# EAGLE design board (EAGLE 9.5.1)
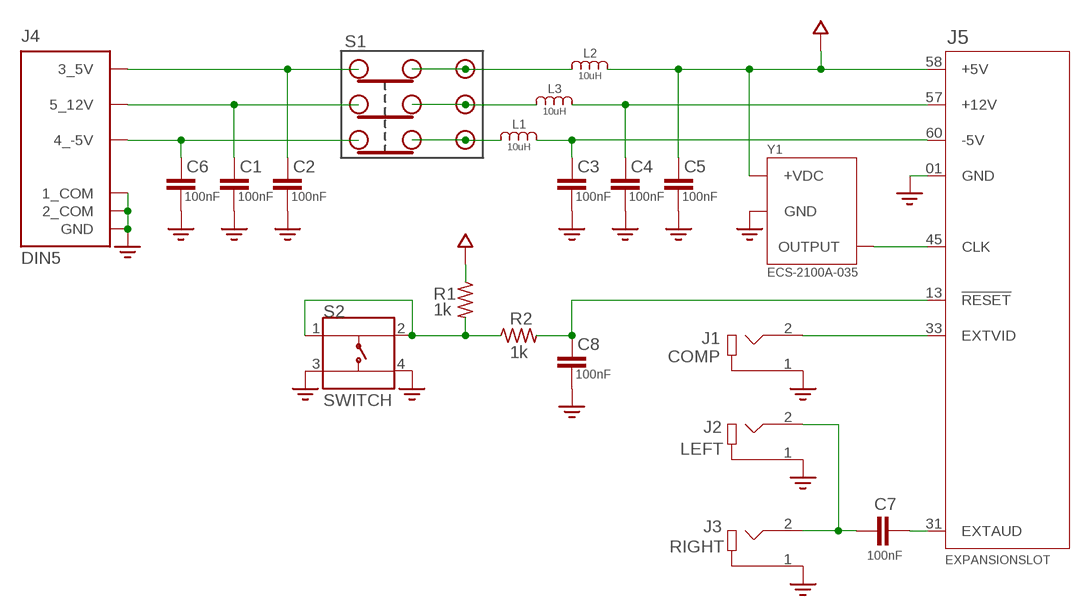
[diagram p0: schematic, sheet 1]

## Parts
C1  100nF  CAPACITOR050-035X075  [C050-035X075]
C2  100nF  CAPACITOR050-035X075  [C050-035X075]
C3  100nF  CAPACITOR050-035X075  [C050-035X075]
C4  100nF  CAPACITOR050-035X075  [C050-035X075]
C5  100nF  CAPACITOR050-035X075  [C050-035X075]
C6  100nF  CAPACITOR050-035X075  [C050-035X075]
C7  100nF  CAPACITOR050-035X075  [C050-035X075]
C8  100nF  CAPACITOR050-035X075  [C050-035X075]
J1  COMP  RCA  [CUI_RCJ-042]
J2  LEFT  RCA  [CUI_RCJ-042]
J3  RIGHT  RCA  [CUI_RCJ-042]
J4  DIN5  [CUI_SDS-50J]
J5  EXPANSIONSLOT  [EXPANSIONSLOT]
L1  10uH  INDUCTOR  [1100R_MUR]
L2  10uH  INDUCTOR  [1100R_MUR]
L3  10uH  INDUCTOR  [1100R_MUR]
R1  1k  RESISTOR0207/10  [0207/10]
R2  1k  RESISTOR0207/10  [0207/10]
S1  3PDT  [3PDT]
S2  SWITCH  [SW_2-1825910-7]
Y1  ECS-2100A-035  [OSC_ECS-2100A-035]

## Nets
5V: C5.1 J5.58(+5V) L2.1 R1.1 Y1.8(+VDC)
5V_IN: C2.1 J4.3(3_5V) S1.P$1C
12V: C4.1 J5.57(+12V) L3.1
12V_IN2: C1.1 J4.5(5_12V) S1.P$2C
GND: C1.2 C2.2 C3.2 C4.2 C5.2 C6.2 C8.2 J1.1 J2.1 J3.1 J4.1(1_COM) J4.2(2_COM) J4.E1(GND) J4.E2(GND) J5.01(GND) S2.3 S2.4 Y1.4(GND)
M5V2: C3.1 J5.60(-5V) L1.1
M5V_IN: C6.1 J4.4(4_-5V) S1.P$3C
N$1: L1.2 S1.P$3A S1.P$3B
N$2: L3.2 S1.P$2A S1.P$2B
N$3: L2.2 S1.P$1A S1.P$1B
N$7: R1.2 R2.1 S2.1 S2.2
N$10: J5.45(CLK) Y1.5(OUTPUT)
N$11: J1.2 J5.33(EXTVID)
N$12: C7.1 J5.31(EXTAUD)
N$14: C8.1 J5.13(!RESET) R2.2
N$15: C7.2 J2.2 J3.2

## Library data of the parts
C1-C8 = expansion1-adapter:CAPACITOR: CAPACITOR, European symbol; SPICEPREFIX: C
J1-J3 = expansion1-adapter:RCA: Metal Right-Angle, RCA Jack, Red Housing and Insulation Check prices <https://pricing.snapeda.com/parts/RCJ-042/CUI%20Devices/view-part?ref=eda>; AVAILABILITY: Good; CUI_PURCHASE_URL: https://www.cuidevices.com/product/interconnect/connectors/rca-connectors/rcj-04-series?utm_source=snapeda.com&utm_medium=referral&utm_campaign=snapedaBOM; DESCRIPTION: Metal Right-Angle, RCA Jack, Red Housing and Insulation; MF: CUI Devices; MP: RCJ-042; PACKAGE: None; PRICE: None; PURCHASE-URL: https://pricing.snapeda.com/search/part/RCJ-042/?ref=eda
J4 = expansion1-adapter:DIN5; CUI_PURCHASE_URL: https://www.cuidevices.com/product/interconnect/connectors/din-connectors/sds-j-series?utm_source=snapeda.com&utm_medium=referral&utm_campaign=snapedaBOM; DESCRIPTION: 3~13 Positions, Receptacle, Right Angle, Through Hole, Standard Circular DIN Connector; DIGI-KEY_PART_NUMBER: CP-2350-ND; MF: CUI Devices; MP: SDS-50J; PACKAGE: None; PURCHASE-URL: https://pricing.snapeda.com/search/part/SDS-50J/?ref=eda
J5 = expansion1-adapter:EXPANSIONSLOT
L1-L3 = expansion1-adapter:INDUCTOR; BUILT_BY: EMA_UL_Team; MANUFACTURER_PART_NUMBER: 11R103C; SOURCELIBRARY: Murata_2012-11-05_1100R; VENDOR: Murata
R1 R2 = expansion1-adapter:RESISTOR: RESISTOR, American symbol
S1 = expansion1-adapter:3PDT: 3PDT slide switch, CW Industries, GF-161-0005
S2 = expansion1-adapter:SWITCH: Switch Tactile OFF (ON) SPST Extended Round Button PC Pins 0.05A 24VDC 100000Cycle 1.57N Thru-Hole Loose Piece; COMMENT: 2-1825910-7; DESCRIPTION: Switch Tactile OFF (ON) SPST Extended Round Button PC Pins 0.05A 24VDC 100000Cycle 1.57N Thru-Hole Loose Piece; DIGI-KEY_PART_NUMBER: 450-1642-ND; EU_ROHS_COMPLIANCE: Compliant; MF: TE Connectivity; MP: 2-1825910-7; PACKAGE: None; PURCHASE-URL: https://pricing.snapeda.com/search/part/2-1825910-7/?ref=eda
Y1 = expansion1-adapter:ECS-2100A-035; DESCRIPTION: Oscillator XO 3.579545MHz ±100ppm 50pF HCMOS/TTL 55% 5V 4-Pin Metal DIP Thru-Hole; DIGI-KEY_PART_NUMBER: XC235-ND; MF: ECS Inc.; MP: ECS-2100A-035; PACKAGE: DIP-8 ECS International; PURCHASE-URL: https://pricing.snapeda.com/search/part/ECS-2100A-035/?ref=eda

## Board
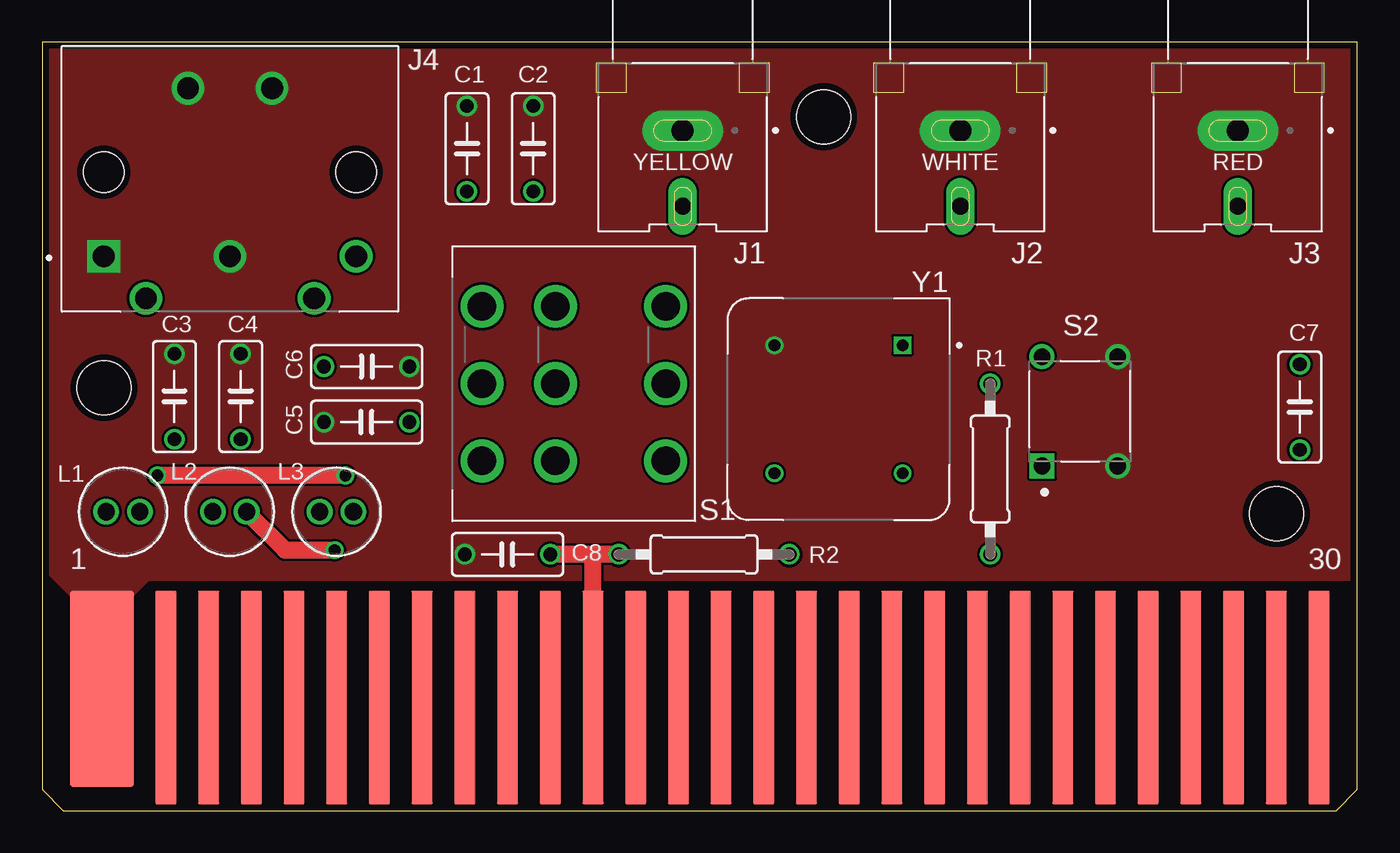
[diagram p1: board, top side]
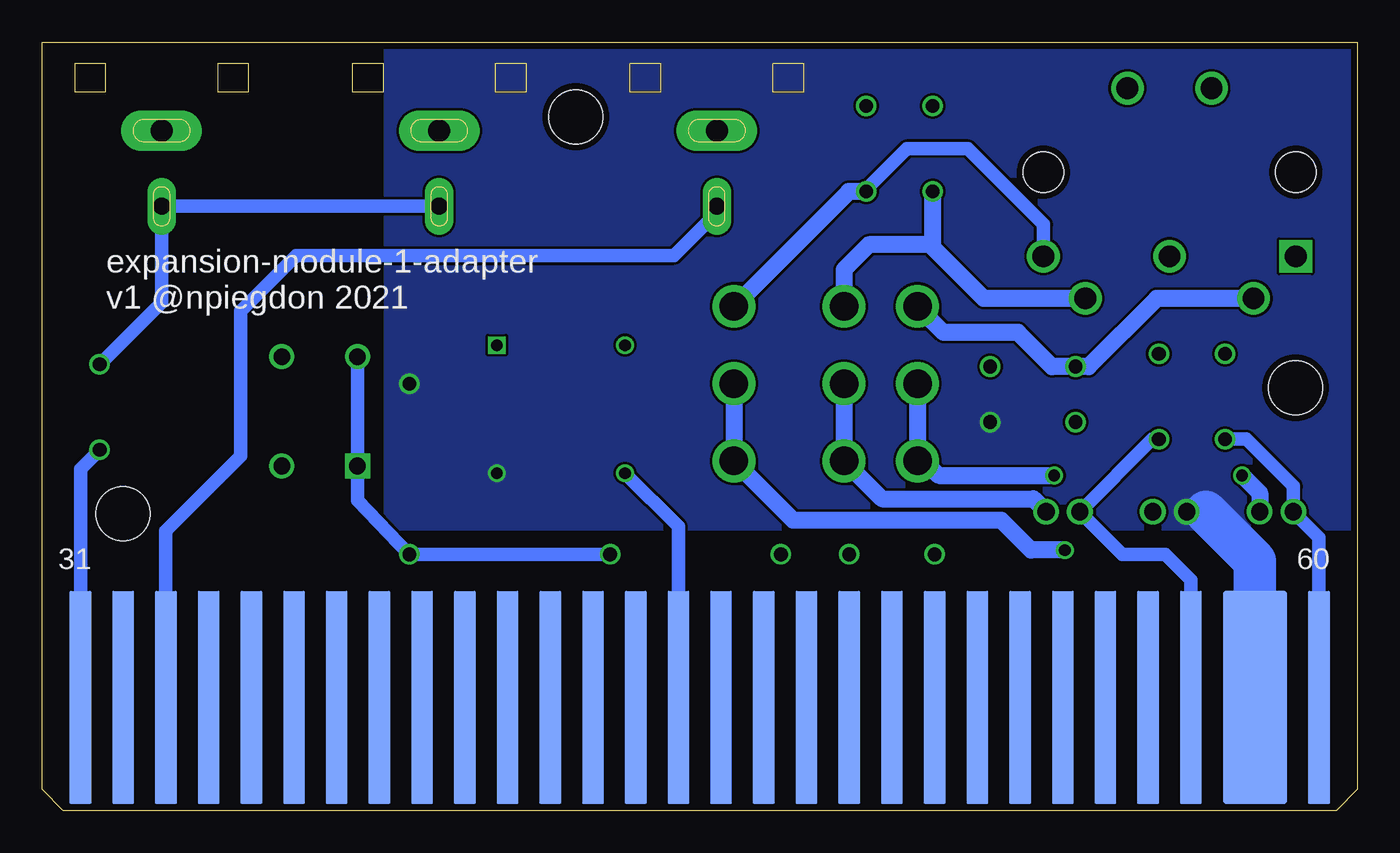
[diagram p2: board, bottom side, seen from below]

Size 78.23 x 45.72 mm. Coordinates in mm from the lower left corner, seen from the top.
Outline: 78.23,45.72 0,45.72 0,1.27 1.27,0 76.96,0 78.23,1.27 78.23,45.72
Copper layers (1*16): Top 0.035559375mm / dielectric 1.6mm / Bottom 0.035559375mm
Design rules "oshpark-2layer-tented": minimum track width 6mil, minimum drill 10mil, track to track 6mil, track to pad 6mil, pad to pad 6mil, via to via 6mil, smd to smd 6mil, copper to edge 15mil, drill to drill 6mil, minimum pad ring 5mil, minimum via ring 5mil, stop-mask expansion 2.5mil, vias tented up to drill 20mil, thermal gap 10mil
Holes 3.2 mm at 46.48,41.27 73.41,17.65 3.68,25.15

### Footprints (pad centres in the part's own frame; a part is rotated, then mirrored left to right if it is on the bottom)
C050-035X075 = drill 0.813: 1 -2.54,0; 2 2.54,0
CUI_RCJ-042 = drill 1.3 pad 2.4 long: 1 -4,0 | drill 1 pad 1.7 long: 2 -8.5,0
CUI_SDS-50J = drill 1.3 square: 1 7.5,5 | drill 1.3: 2 0,5; 3 -7.5,5; 4 5,7.5; 5 -5,7.5; E1 -2.5,-5; E2 2.5,-5 | hole 2.4: 7.5,0; -7.5,0
EXPANSIONSLOT = smd 3.81 x 11.684: 01 1.905,6.858 | smd 1.27 x 12.7: 03 5.715,6.35; 04 8.255,6.35; 05 10.795,6.35; 06 13.335,6.35; 07 15.875,6.35; 08 18.415,6.35; 09 20.955,6.35; 10 23.495,6.35; 11 26.035,6.35; 12 28.575,6.35; 13 31.115,6.35; 14 33.655,6.35; 15 36.195,6.35; 16 38.735,6.35; 17 41.275,6.35; 18 43.815,6.35; 19 46.355,6.35; 20 48.895,6.35; 21 51.435,6.35; 22 53.975,6.35; 23 56.515,6.35; 24 59.055,6.35; 25 61.595,6.35; 26 64.135,6.35; 27 66.675,6.35; 28 69.215,6.35; 29 71.755,6.35; 30 74.295,6.35 | smd 1.27 x 12.7 bottom: 31 74.295,6.35; 32 71.755,6.35; 33 69.215,6.35; 34 66.675,6.35; 35 64.135,6.35; 36 61.595,6.35; 37 59.055,6.35; 38 56.515,6.35; 39 53.975,6.35; 40 51.435,6.35; 41 48.895,6.35; 42 46.355,6.35; 43 43.815,6.35; 44 41.275,6.35; 45 38.735,6.35; 46 36.195,6.35; 47 33.655,6.35; 48 31.115,6.35; 49 28.575,6.35; 50 26.035,6.35; 51 23.495,6.35; 52 20.955,6.35; 53 18.415,6.35; 54 15.875,6.35; 55 13.335,6.35; 56 10.795,6.35; 57 8.255,6.35; 60 0.635,6.35 | smd 3.81 x 12.7 bottom: 58 4.445,6.35
1100R_MUR = drill 1.016 pad 1.524: 1 0,0; 2 2.007,0
0207/10 = drill 0.813: 1 -5.08,0; 2 5.08,0
3PDT = drill 1.702: P$1A -4.597,-5.461; P$1B 0,-5.461; P$1C 4.597,-5.461; P$2A -4.597,1.092; P$2B 0,1.092; P$2C 4.597,1.092; P$3A -4.597,5.461; P$3B 0,5.461; P$3C 4.597,5.461
SW_2-1825910-7 = drill 0.99 square: 1 -3.25,2.25 | drill 0.99: 2 3.25,2.25; 3 -3.25,-2.25; 4 3.25,-2.25
OSC_ECS-2100A-035 = drill 0.7 square: 1 -3.81,-3.81 | drill 0.7: 4 3.81,-3.81; 5 3.81,3.81; 8 -3.81,3.81

### Placement (x,y rotation side)
C1  25.27,39.37 90 top
C2  29.21,39.37 90 top
C3  7.87,24.64 90 top
C4  11.81,24.64 90 top
C5  19.3,23.11 180 top
C6  19.3,26.42 0 top
C7  74.8,24 90 top
C8  27.69,15.24 180 top
J1  38.1,44.45 90 top
J2  54.61,44.45 90 top
J3  71.12,44.45 90 top
J4  11.18,37.97 180 top
J5  1.65,0.38 0 top
L1  3.81,17.78 0 top
L2  10.16,17.78 0 top
L3  16.51,17.78 0 top
R1  56.39,20.32 270 top
R2  39.37,15.24 180 top
S1  31.62,25.4 90 top
S2  61.72,23.75 90 top
Y1  47.37,23.88 180 top

### Tracks (layer width: path | path; a pad name or v marks a point on that pad's centre or on a via)
5V
  Bottom 1.27: L2.1 9.02,17.78
  Bottom 2.54: 9.02,17.78 6.1,14.86 J5.58
  pour Bottom: -1.65,46.99 -1.65,16.89 57.66,16.89 57.66,46.99
5V_IN
  Bottom 0.813: J4.3 18.68,34.88 23.17,39.37 26.8,39.37 29.21,36.96 C2.1
  Bottom 1.016: C2.1 30.25,36.83 S1.P$1C
12V
  Bottom 0.813: J5.57 9.91,13.72 11.43,15.24 13.97,15.24 L3.1 12.19,22.1 C4.1
12V_IN2
  Bottom 1.016: J4.5 22.22,30.47 25.27,33.53 | 25.27,33.53 25.4,33.66 29.06,33.66 30.53,32.18 S1.P$2C | C1.1 25.27,33.53
GND
  pour Top: -1.27,52.07 -1.27,14.73 -0.25,14.73 1.78,12.7 5.33,12.7 6.35,13.72 78.99,13.72 78.99,51.82 -1.02,51.82
M5V2
  Bottom 0.813: J5.60 2.29,16.26 L1.1 3.81,19.3 6.6,22.1 C3.1
M5V_IN
  Bottom 1.016: J4.4 11.95,30.47 16,26.42 C6.1 18.16,26.42 20.19,28.45 24.61,28.45 S1.P$3C
N$1  (via drill 0.7)
  Top 1.016: v18.03,19.94 v6.86,19.94
  Bottom 1.016: S1.P$3B S1.P$3A 25.78,20.8 24.92,19.94 v18.03,19.94 | L1.2 5.82,18.9 v6.86,19.94
N$2
  Bottom 1.016: S1.P$2B S1.P$2A 28.27,18.54 19.28,18.54 L3.2
N$3  (via drill 0.7)
  Top 1.016: L2.2 14.45,15.49 v17.4,15.49
  Bottom 1.016: S1.P$1B S1.P$1A 33.55,17.27 21.19,17.27 19.41,15.49 v17.4,15.49
N$7
  Bottom 0.813: S2.2 S2.1 59.47,18.45 R1.2 R2.1
N$10
  Bottom 0.813: J5.45 40.39,16.89 Y1.5
N$11
  Bottom 0.813: J5.33 70.87,16.64 66.42,21.08 66.42,29.72 63.12,33.02 40.64,33.02 38.1,35.56 J1.2
N$12
  Bottom 0.813: J5.31 75.95,20.32 C7.1
N$14
  Top 1.016: R2.2 32.77,15.24 | 32.77,15.24 C8.1 | J5.13 32.77,15.24
N$15
  Bottom 0.813: C7.2 71.12,30.23 J3.2 J2.2

### Text on the board
tNames: YELLOW | WHITE | RED
bNames: expansion-module-1-adapter / v1 @npiegdon 2021